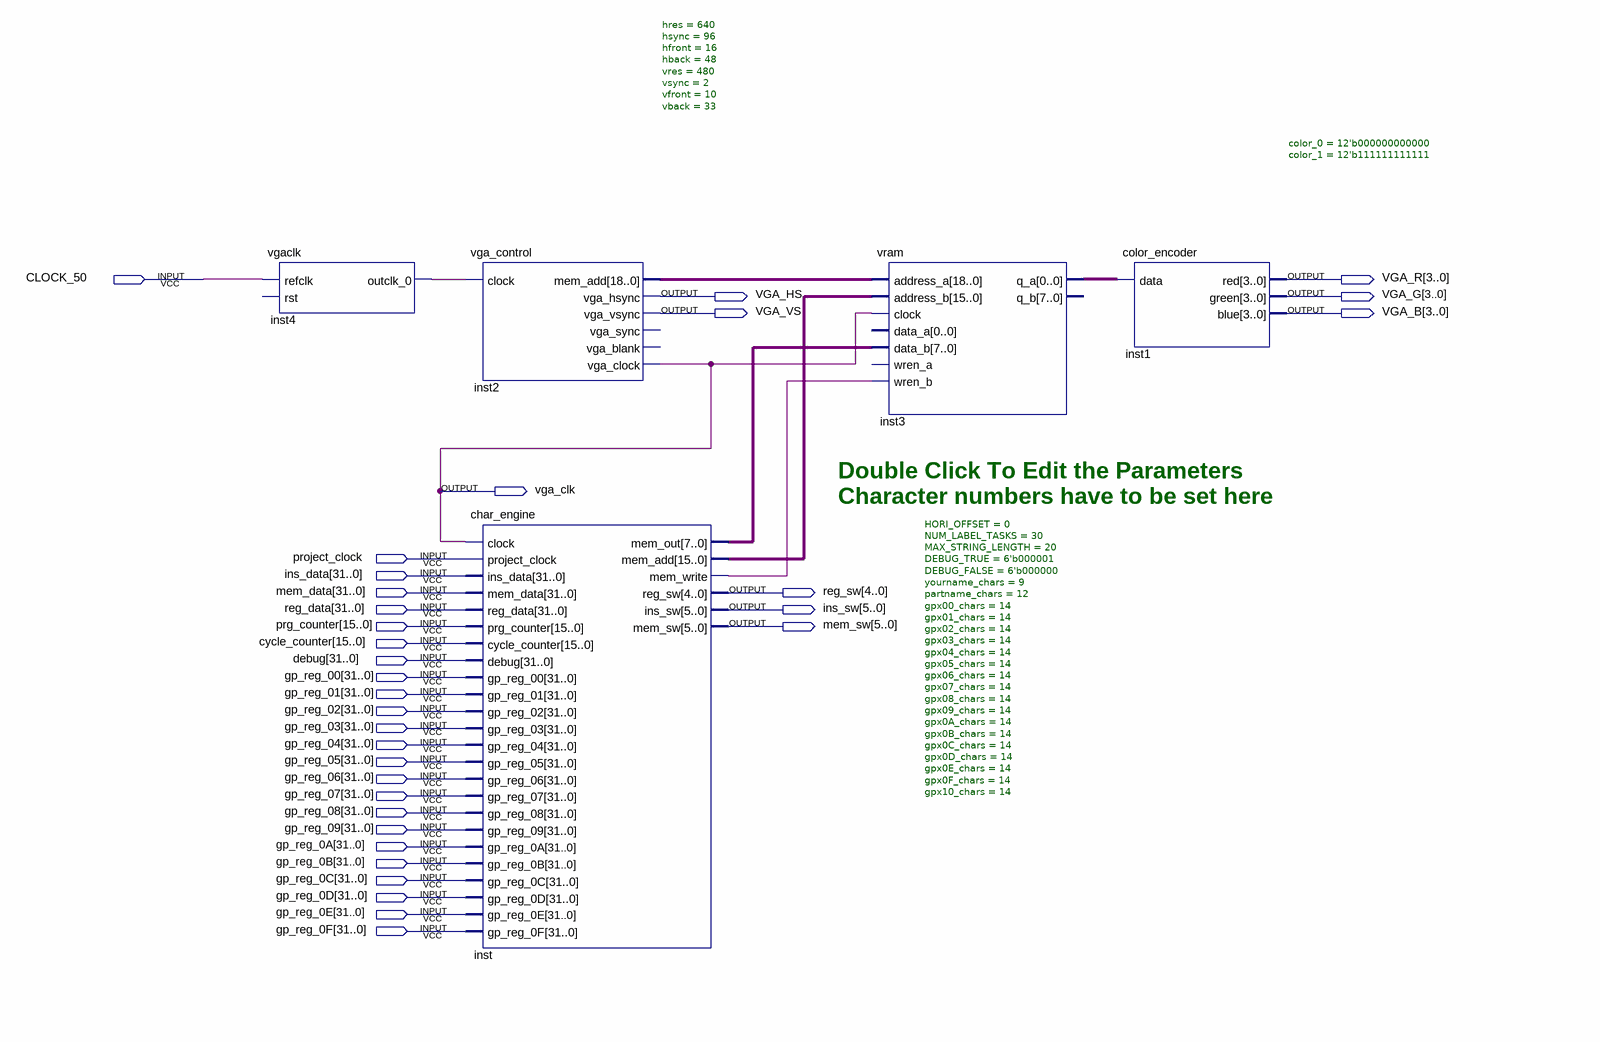
[diagram p0: schematic sheet]
// Quartus schematic VGA_BLOCK.bdf as structural Verilog: 5 symbols, 33 pins
module VGA_BLOCK (
  input  CLOCK_50,
  input  project_clock,
  input  [31:0] ins_data,
  input  [31:0] mem_data,
  input  [31:0] reg_data,
  input  [15:0] prg_counter,
  input  [15:0] cycle_counter,
  input  [31:0] debug,
  input  [31:0] gp_reg_00,
  input  [31:0] gp_reg_01,
  input  [31:0] gp_reg_02,
  input  [31:0] gp_reg_03,
  input  [31:0] gp_reg_04,
  input  [31:0] gp_reg_05,
  input  [31:0] gp_reg_06,
  input  [31:0] gp_reg_07,
  input  [31:0] gp_reg_08,
  input  [31:0] gp_reg_09,
  input  [31:0] gp_reg_0A,
  input  [31:0] gp_reg_0B,
  input  [31:0] gp_reg_0C,
  input  [31:0] gp_reg_0D,
  input  [31:0] gp_reg_0E,
  input  [31:0] gp_reg_0F,
  output [3:0] VGA_R,
  output VGA_HS,
  output [3:0] VGA_G,
  output VGA_VS,
  output [3:0] VGA_B,
  output vga_clk,
  output [4:0] reg_sw,
  output [5:0] ins_sw,
  output [5:0] mem_sw
);

  wire inst3_q_a, inst4_outclk_0, inst_mem_write;
  wire [7:0] inst_mem_out;
  wire [15:0] inst_mem_add;
  wire [18:0] inst2_mem_add;

  vgaclk inst4 (.refclk(CLOCK_50), .outclk_0(inst4_outclk_0));  // open: rst
  vga_control #(.hres(640), .hsync(96), .hfront(16), .hback(48), .vres(480), .vsync(2), .vfront(10), .vback(33)) inst2 (
    .clock(inst4_outclk_0), .mem_add(inst2_mem_add), .vga_hsync(VGA_HS), .vga_vsync(VGA_VS),
    .vga_clock(vga_clk));  // open: vga_sync, vga_blank
  char_engine #(.HORI_OFFSET(0), .NUM_LABEL_TASKS(30), .MAX_STRING_LENGTH(20), .DEBUG_TRUE(6'b000001), .DEBUG_FALSE(6'b000000), .yourname_chars(9), .partname_chars(12), .gpx00_chars(14), .gpx01_chars(14), .gpx02_chars(14), .gpx03_chars(14), .gpx04_chars(14), .gpx05_chars(14), .gpx06_chars(14), .gpx07_chars(14), .gpx08_chars(14), .gpx09_chars(14), .gpx0A_chars(14), .gpx0B_chars(14), .gpx0C_chars(14), .gpx0D_chars(14), .gpx0E_chars(14), .gpx0F_chars(14), .gpx10_chars(14)) inst (
    .clock(vga_clk), .project_clock(project_clock), .ins_data(ins_data), .mem_data(mem_data),
    .reg_data(reg_data), .prg_counter(prg_counter), .cycle_counter(cycle_counter), .debug(debug),
    .gp_reg_00(gp_reg_00), .gp_reg_01(gp_reg_01), .gp_reg_02(gp_reg_02), .gp_reg_03(gp_reg_03),
    .gp_reg_04(gp_reg_04), .gp_reg_05(gp_reg_05), .gp_reg_06(gp_reg_06), .gp_reg_07(gp_reg_07),
    .gp_reg_08(gp_reg_08), .gp_reg_09(gp_reg_09), .gp_reg_0A(gp_reg_0A), .gp_reg_0B(gp_reg_0B),
    .gp_reg_0C(gp_reg_0C), .gp_reg_0D(gp_reg_0D), .gp_reg_0E(gp_reg_0E), .gp_reg_0F(gp_reg_0F),
    .mem_out(inst_mem_out), .mem_add(inst_mem_add), .mem_write(inst_mem_write), .reg_sw(reg_sw),
    .ins_sw(ins_sw), .mem_sw(mem_sw));
  vram inst3 (
    .address_a(inst2_mem_add), .address_b(inst_mem_add), .clock(vga_clk), .data_b(inst_mem_out),
    .wren_b(inst_mem_write), .q_a(inst3_q_a));  // open: data_a, wren_a, q_b
  color_encoder #(.color_0(12'b000000000000), .color_1(12'b111111111111)) inst1 (
    .data(inst3_q_a), .red(VGA_R), .green(VGA_G), .blue(VGA_B));

  // Notes on the sheet:
  //   Double Click To Edit the Parameters
  //   Character numbers have to be set here
  //   `
endmodule
